# Altium schematic sheet SAU-G0-EX_TMPL.SchDoc
size A4
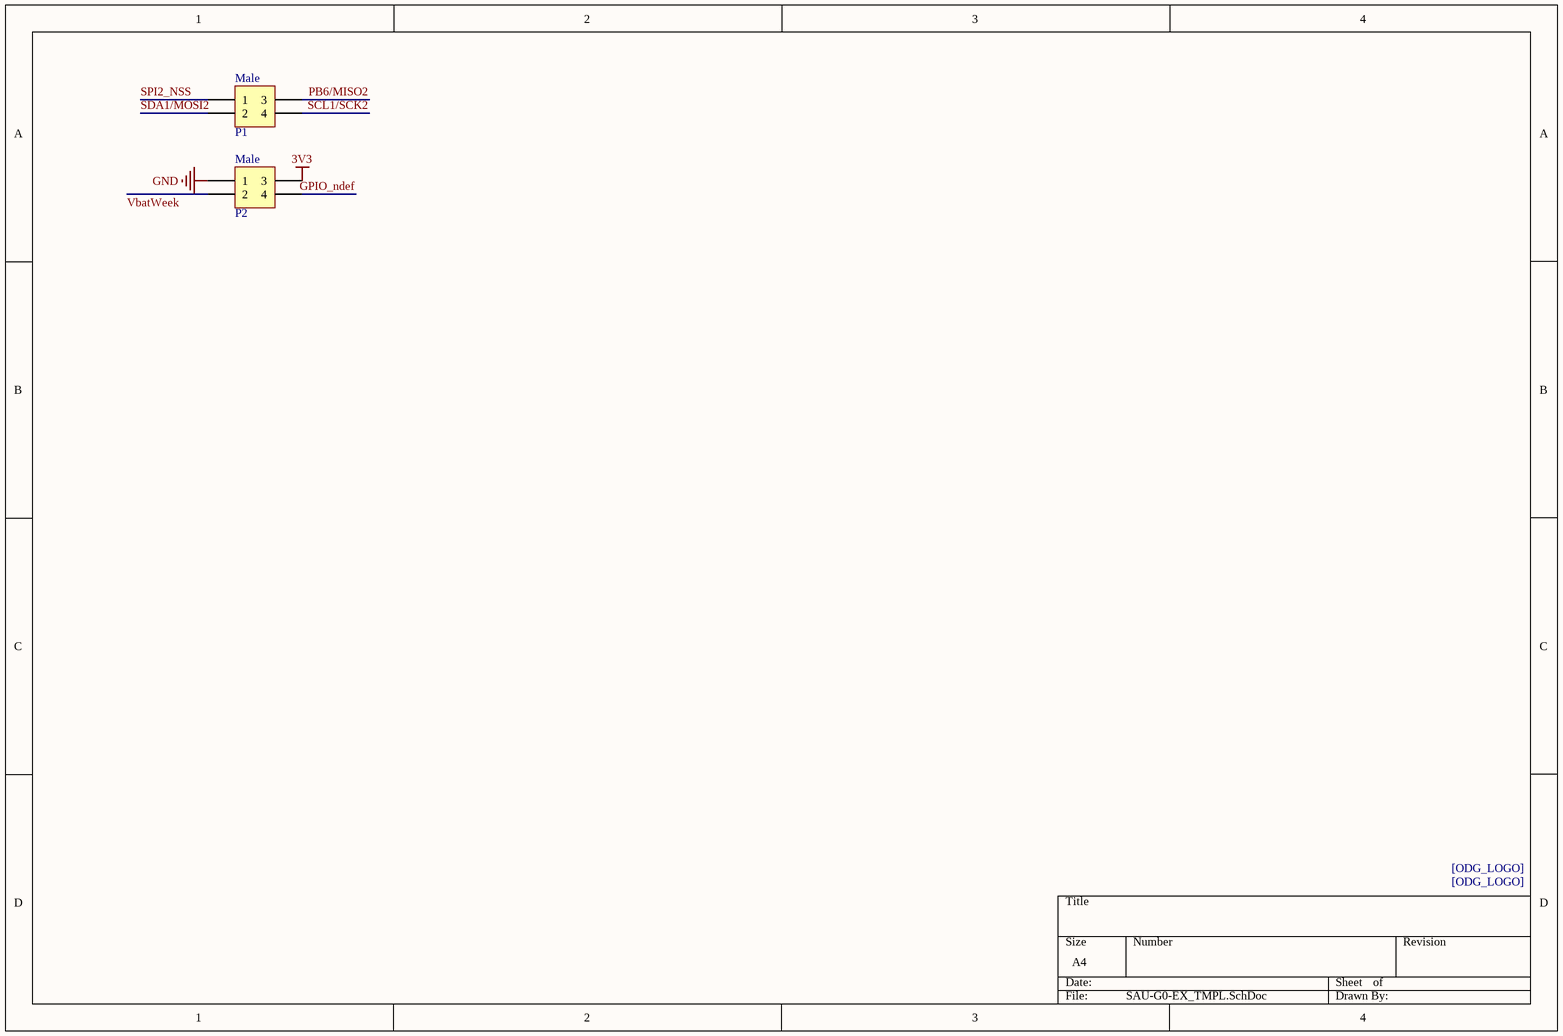
[diagram p0: SAU-G0-EX_TMPL.SchDoc]

## Parts
ODG1  ODG_LOGO  [ODG_LOGO_soldermask]  (value not drawn)
ODG2  ODG_LOGO  [ODG_LOGO_soldermask]  (value not drawn)
P1  Male  [2.0mm_Male_2x2]
P2  Male  [2.0mm_Male_2x2]

## Nets
3V3: P2.3
GND: P2.1
GPIO_ndef: P2.4
PB6/MISO2: P1.3
SCL1/SCK2: P1.4
SDA1/MOSI2: P1.2
SPI2_NSS: P1.1
VbatWeek: P2.2

## Notes on the sheet
- (in symbol ODG_LOGO) [ODG_LOGO]

## Library data of the parts
P1 P2 = CONN_2X2